# EasyEDA schematic serial plotter easyEDA.json
TITLE: Sheet_1; REV: 1.0; Date: 2023-09-15; Sheet: 1/1; Company: Your Company
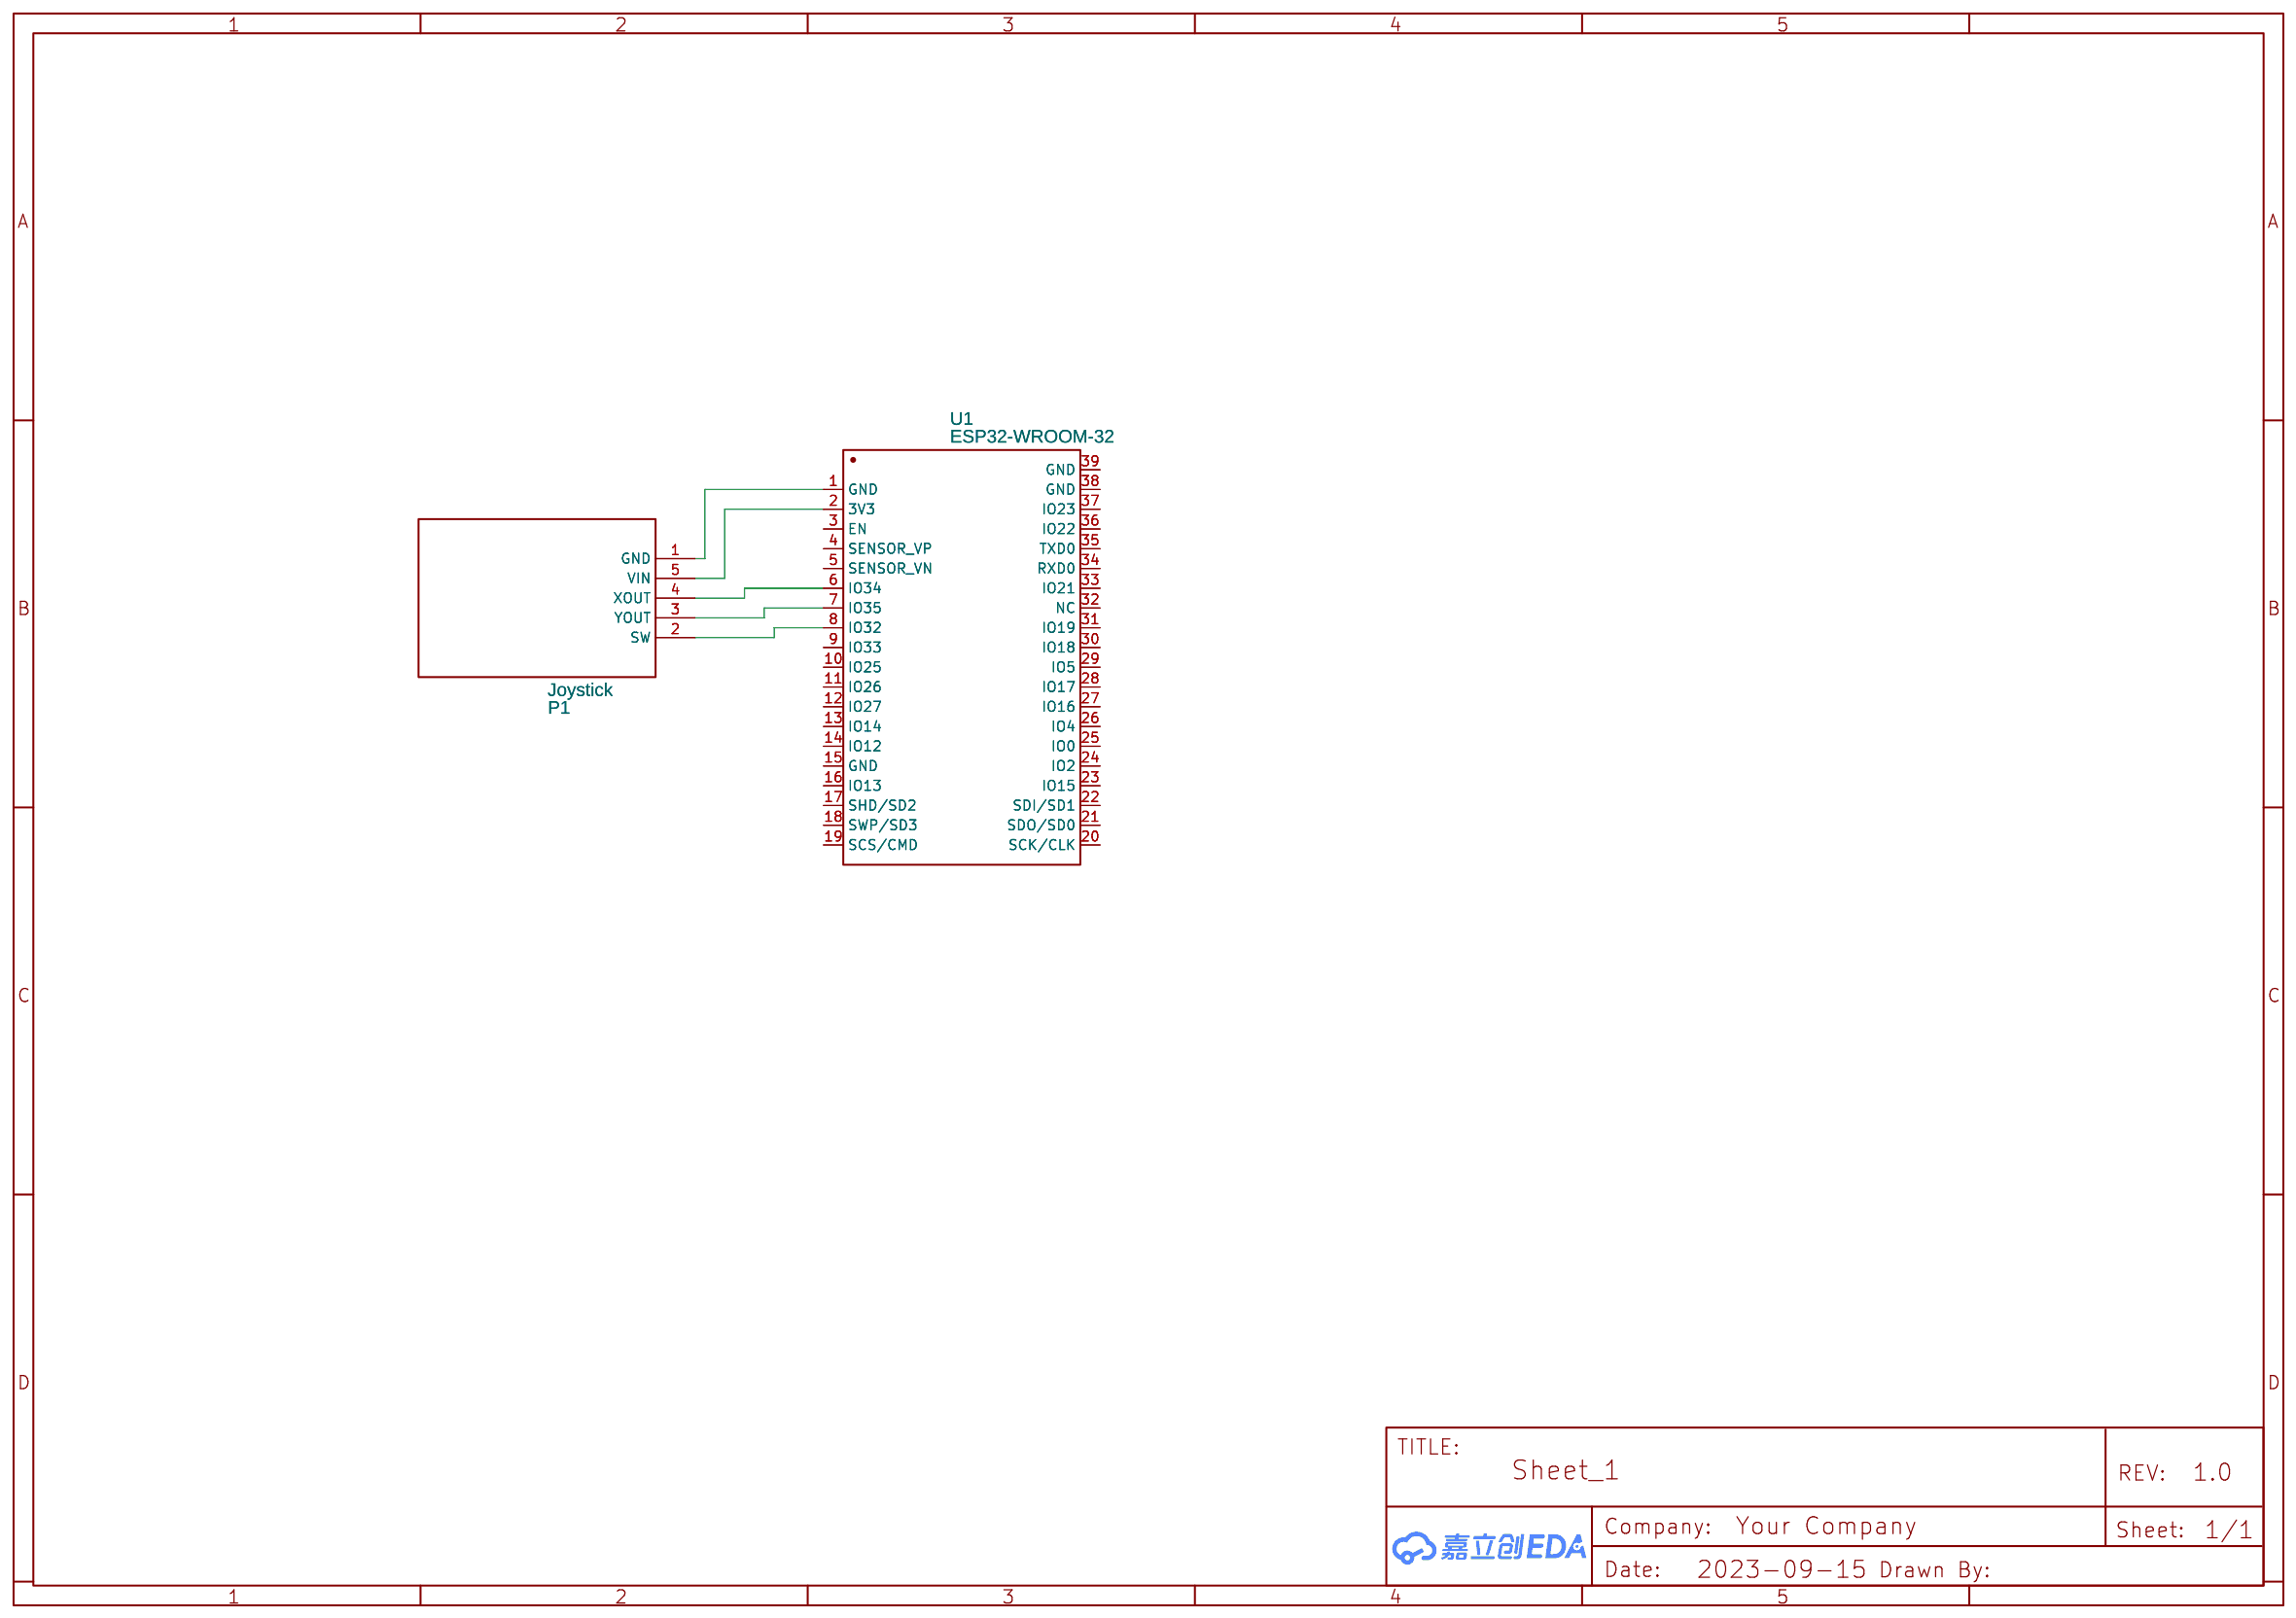
[diagram p0: schematic sheet]

## Parts
P1  Joystick  [JOYSTICK]
U1  ESP32-WROOM-32  [WIFIM-SMD_ESP32-WROOM-32-N4]

## Library data of the parts
P1 = Joystick: sourceId: 1T5FDZYC8; Supplier: AdaFruit
U1 = ESP32-WROOM-32: Contributor: LCSC; Supplier: LCSC; Supplier Part: C82899; Manufacturer: ESPRESSIF(乐鑫); JLCPCB Part Class: Extended Part

## Nets
Net-(P1-1): P1.1(GND) U1.1(GND)
Net-(P1-2): P1.2(SW) U1.8(IO32)
Net-(P1-3): P1.3(YOUT) U1.7(IO35)
Net-(P1-4): P1.4(XOUT) U1.6(IO34)
Net-(P1-5): P1.5(VIN) U1.2(3V3)

Not connected (* = marked no-connect by the designer): U1 3(EN) 4(SENSOR_VP) 5(SENSOR_VN) 9(IO33) 10(IO25) 11(IO26) 12(IO27) 13(IO14) 14(IO12) 15(GND) 16(IO13) 17(SHD/SD2) 18(SWP/SD3) 19(SCS/CMD) 20(SCK/CLK) 21(SDO/SD0) 22(SDI/SD1) 23(IO15) 24(IO2) 25(IO0) 26(IO4) 27(IO16) 28(IO17) 29(IO5) 30(IO18) 31(IO19) 32(NC) 33(IO21) 34(RXD0) 35(TXD0) 36(IO22) 37(IO23) 38(GND) 39(GND)
